# EAGLE design PGTN021_octasource_mkiii_controls (EAGLE 9.6.0)
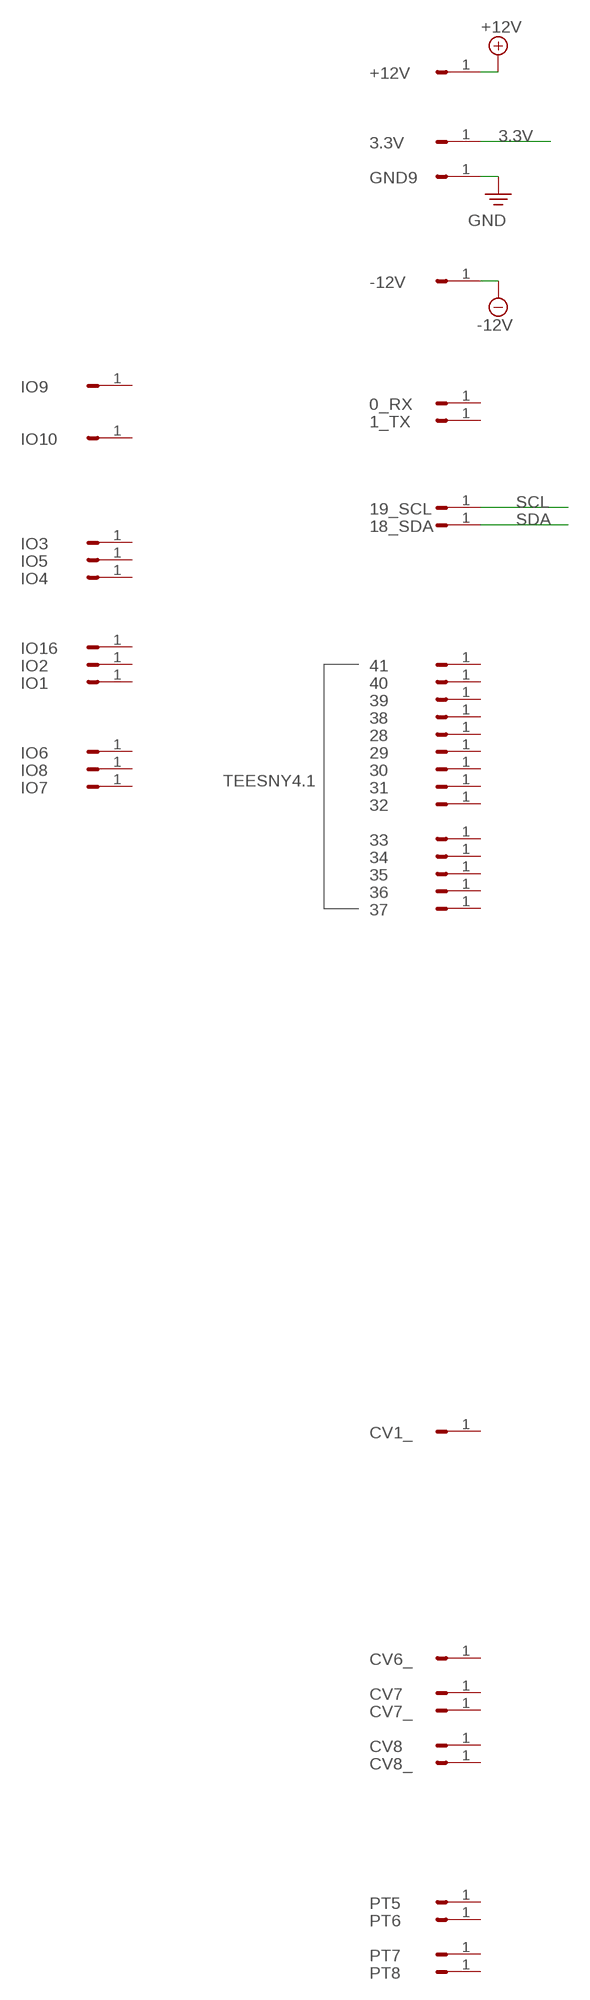
[diagram p0: schematic, sheet 1, part 1 of 2]
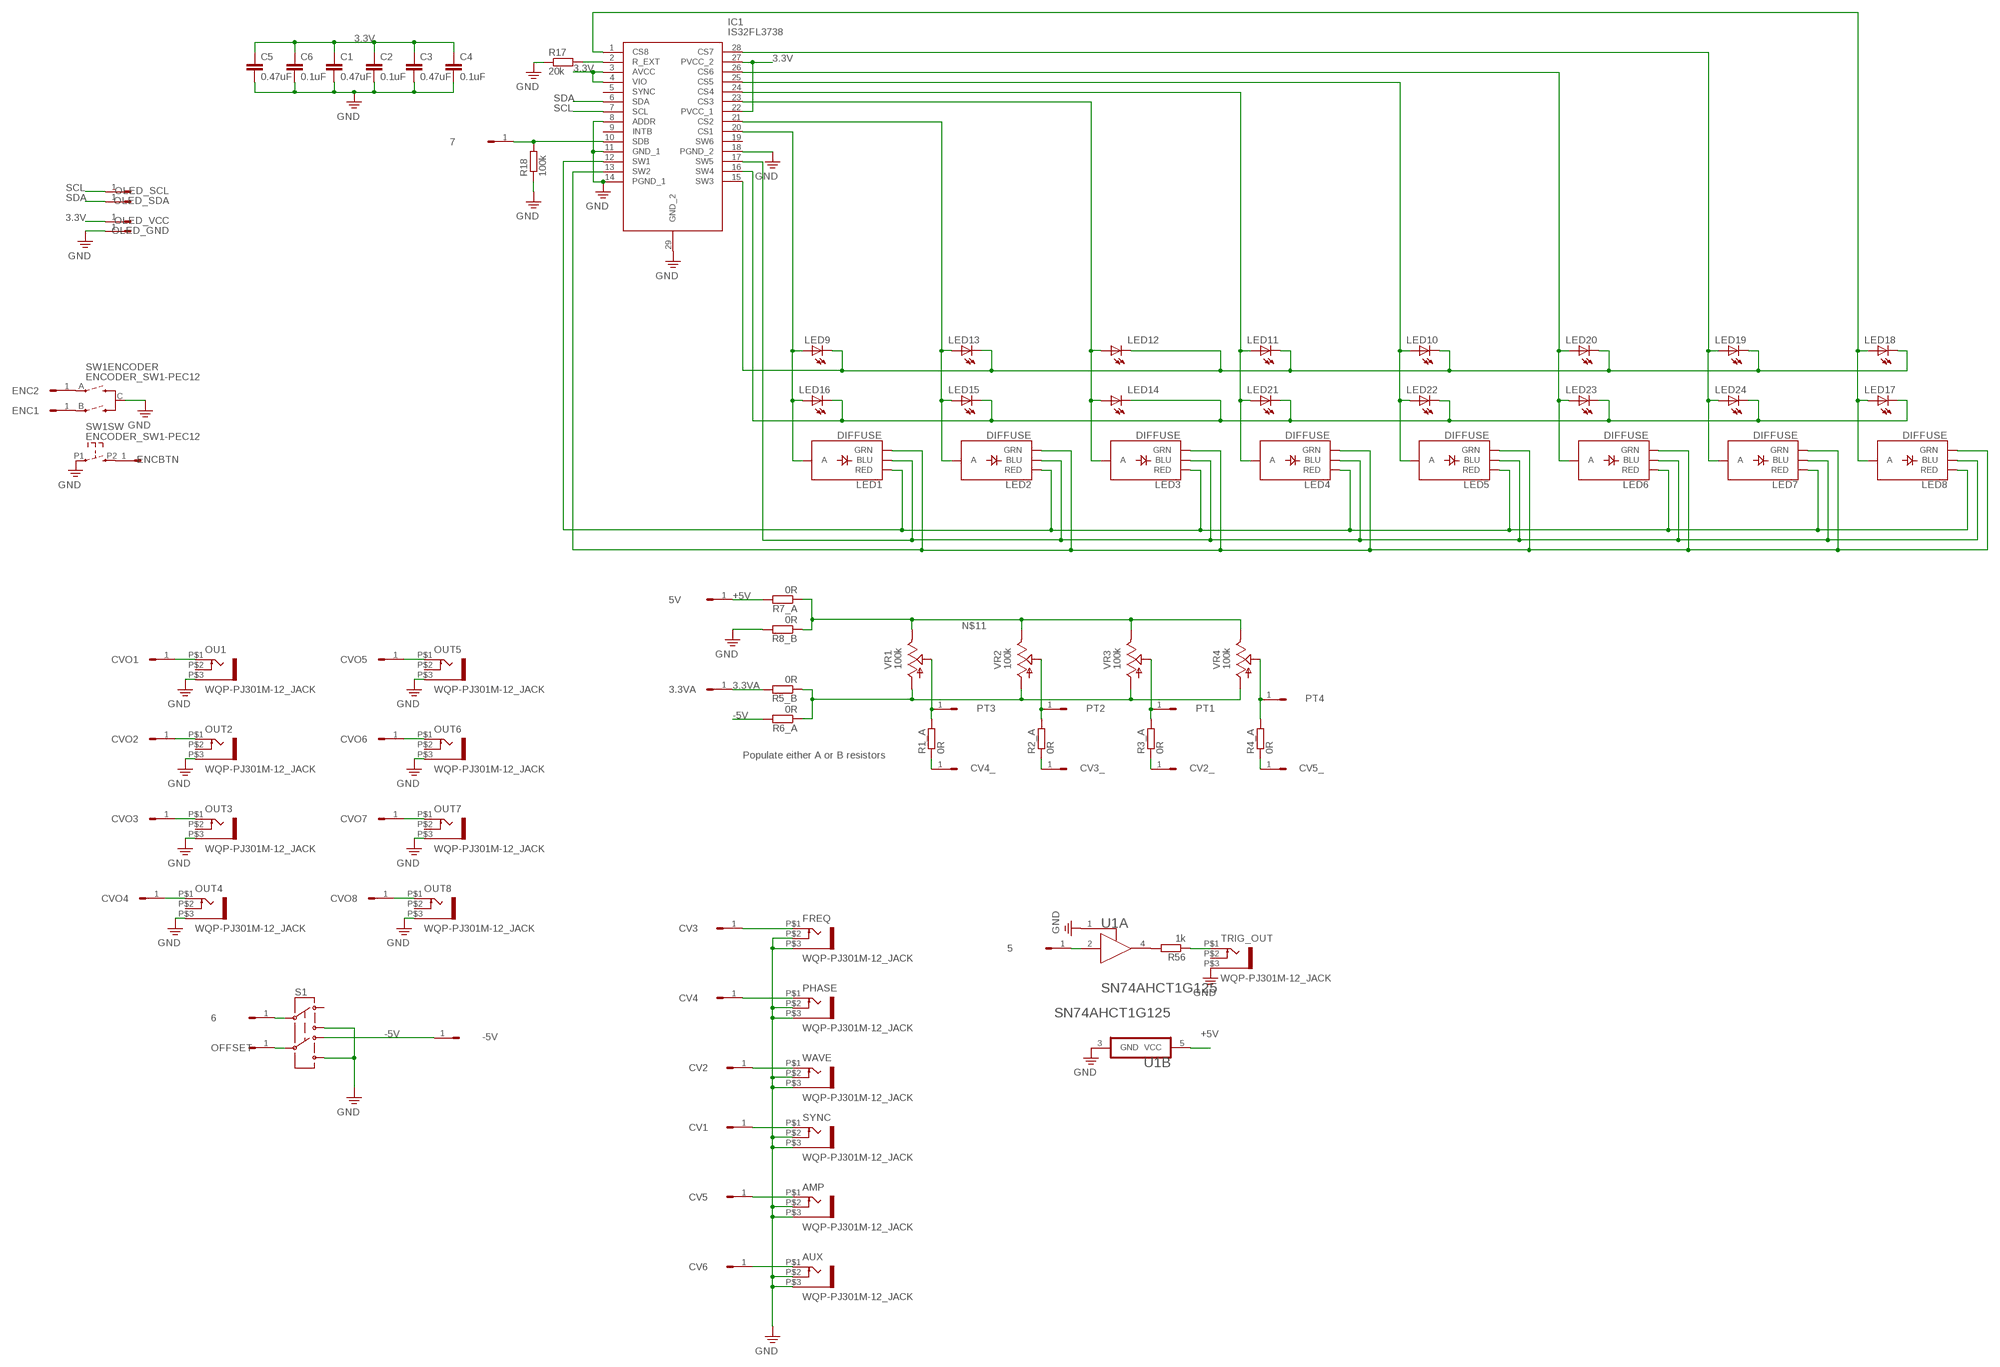
[diagram p1: schematic, sheet 1, part 2 of 2]

## Parts
0_RX  HEADER/MALE/01  [HEADER/MALE/01]
1_TX  HEADER/MALE/01  [HEADER/MALE/01]
3.3V  HEADER/MALE/01  [HEADER/MALE/01]
3.3VA  HEADER/MALE/01  [HEADER/MALE/01]
5  HEADER/MALE/01  [HEADER/MALE/01]
5V  HEADER/MALE/01  [HEADER/MALE/01]
6  HEADER/MALE/01  [HEADER/MALE/01]
7  HEADER/MALE/01  [HEADER/MALE/01]
18_SDA  HEADER/MALE/01  [HEADER/MALE/01]
19_SCL  HEADER/MALE/01  [HEADER/MALE/01]
28  HEADER/MALE/01  [HEADER/MALE/01]
29  HEADER/MALE/01  [HEADER/MALE/01]
30  HEADER/MALE/01  [HEADER/MALE/01]
31  HEADER/MALE/01  [HEADER/MALE/01]
32  HEADER/MALE/01  [HEADER/MALE/01]
33  HEADER/MALE/01  [HEADER/MALE/01]
34  HEADER/MALE/01  [HEADER/MALE/01]
35  HEADER/MALE/01  [HEADER/MALE/01]
36  HEADER/MALE/01  [HEADER/MALE/01]
37  HEADER/MALE/01  [HEADER/MALE/01]
38  HEADER/MALE/01  [HEADER/MALE/01]
39  HEADER/MALE/01  [HEADER/MALE/01]
40  HEADER/MALE/01  [HEADER/MALE/01]
41  HEADER/MALE/01  [HEADER/MALE/01]
+12V  HEADER/MALE/01  [HEADER/MALE/01]
-5V  HEADER/MALE/01  [HEADER/MALE/01]
-12V  HEADER/MALE/01  [HEADER/MALE/01]
AMP  WQP-PJ301M-12_JACK  [WQP-PJ301M-12_JACK]
AUX  WQP-PJ301M-12_JACK  [WQP-PJ301M-12_JACK]
C1  0.47uF  CAPACITORC0603  [C0603]
C2  0.1uF  CAPACITORC0603  [C0603]
C3  0.47uF  CAPACITORC0603  [C0603]
C4  0.1uF  CAPACITORC0603  [C0603]
C5  0.47uF  CAPACITORC0603  [C0603]
C6  0.1uF  CAPACITORC0603  [C0603]
CV1  HEADER/MALE/01  [HEADER/MALE/01]
CV1_  HEADER/MALE/01  [HEADER/MALE/01]
CV2  HEADER/MALE/01  [HEADER/MALE/01]
CV2_  HEADER/MALE/01  [HEADER/MALE/01]
CV3  HEADER/MALE/01  [HEADER/MALE/01]
CV3_  HEADER/MALE/01  [HEADER/MALE/01]
CV4  HEADER/MALE/01  [HEADER/MALE/01]
CV4_  HEADER/MALE/01  [HEADER/MALE/01]
CV5  HEADER/MALE/01  [HEADER/MALE/01]
CV5_  HEADER/MALE/01  [HEADER/MALE/01]
CV6  HEADER/MALE/01  [HEADER/MALE/01]
CV6_  HEADER/MALE/01  [HEADER/MALE/01]
CV7  HEADER/MALE/01  [HEADER/MALE/01]
CV7_  HEADER/MALE/01  [HEADER/MALE/01]
CV8  HEADER/MALE/01  [HEADER/MALE/01]
CV8_  HEADER/MALE/01  [HEADER/MALE/01]
CVO1  HEADER/MALE/01  [HEADER/MALE/01]
CVO2  HEADER/MALE/01  [HEADER/MALE/01]
CVO3  HEADER/MALE/01  [HEADER/MALE/01]
CVO4  HEADER/MALE/01  [HEADER/MALE/01]
CVO5  HEADER/MALE/01  [HEADER/MALE/01]
CVO6  HEADER/MALE/01  [HEADER/MALE/01]
CVO7  HEADER/MALE/01  [HEADER/MALE/01]
CVO8  HEADER/MALE/01  [HEADER/MALE/01]
ENC1  HEADER/MALE/01  [HEADER/MALE/01]
ENC2  HEADER/MALE/01  [HEADER/MALE/01]
ENCBTN  HEADER/MALE/01  [HEADER/MALE/01]
FREQ  WQP-PJ301M-12_JACK  [WQP-PJ301M-12_JACK]
GND9  HEADER/MALE/01  [HEADER/MALE/01]
IC1  IS32FL3738  [TSSOP29]
IO1  HEADER/MALE/01  [HEADER/MALE/01]
IO2  HEADER/MALE/01  [HEADER/MALE/01]
IO3  HEADER/MALE/01  [HEADER/MALE/01]
IO4  HEADER/MALE/01  [HEADER/MALE/01]
IO5  HEADER/MALE/01  [HEADER/MALE/01]
IO6  HEADER/MALE/01  [HEADER/MALE/01]
IO7  HEADER/MALE/01  [HEADER/MALE/01]
IO8  HEADER/MALE/01  [HEADER/MALE/01]
IO9  HEADER/MALE/01  [HEADER/MALE/01]
IO10  HEADER/MALE/01  [HEADER/MALE/01]
IO16  HEADER/MALE/01  [HEADER/MALE/01]
LED1  DIFFUSE  LED-RGB-CADIFFUSE  [LED-RGB-THRU]
LED2  DIFFUSE  LED-RGB-CADIFFUSE  [LED-RGB-THRU]
LED3  DIFFUSE  LED-RGB-CADIFFUSE  [LED-RGB-THRU]
LED4  DIFFUSE  LED-RGB-CADIFFUSE  [LED-RGB-THRU]
LED5  DIFFUSE  LED-RGB-CADIFFUSE  [LED-RGB-THRU]
LED6  DIFFUSE  LED-RGB-CADIFFUSE  [LED-RGB-THRU]
LED7  DIFFUSE  LED-RGB-CADIFFUSE  [LED-RGB-THRU]
LED8  DIFFUSE  LED-RGB-CADIFFUSE  [LED-RGB-THRU]
LED9  LEDCHIPLED_0805  [CHIPLED_0805]
LED10  LEDCHIPLED_0805  [CHIPLED_0805]
LED11  LEDCHIPLED_0805  [CHIPLED_0805]
LED12  LEDCHIPLED_0805  [CHIPLED_0805]
LED13  LEDCHIPLED_0805  [CHIPLED_0805]
LED14  LEDCHIPLED_0805  [CHIPLED_0805]
LED15  LEDCHIPLED_0805  [CHIPLED_0805]
LED16  LEDCHIPLED_0805  [CHIPLED_0805]
LED17  LEDCHIPLED_0805  [CHIPLED_0805]
LED18  LEDCHIPLED_0805  [CHIPLED_0805]
LED19  LEDCHIPLED_0805  [CHIPLED_0805]
LED20  LEDCHIPLED_0805  [CHIPLED_0805]
LED21  LEDCHIPLED_0805  [CHIPLED_0805]
LED22  LEDCHIPLED_0805  [CHIPLED_0805]
LED23  LEDCHIPLED_0805  [CHIPLED_0805]
LED24  LEDCHIPLED_0805  [CHIPLED_0805]
OFFSET  HEADER/MALE/01  [HEADER/MALE/01]
OLED_GND  HEADER/MALE/01  [HEADER/MALE/01]
OLED_SCL  HEADER/MALE/01  [HEADER/MALE/01]
OLED_SDA  HEADER/MALE/01  [HEADER/MALE/01]
OLED_VCC  HEADER/MALE/01  [HEADER/MALE/01]
OU1  WQP-PJ301M-12_JACK  [WQP-PJ301M-12_JACK]
OUT2  WQP-PJ301M-12_JACK  [WQP-PJ301M-12_JACK]
OUT3  WQP-PJ301M-12_JACK  [WQP-PJ301M-12_JACK]
OUT4  WQP-PJ301M-12_JACK  [WQP-PJ301M-12_JACK]
OUT5  WQP-PJ301M-12_JACK  [WQP-PJ301M-12_JACK]
OUT6  WQP-PJ301M-12_JACK  [WQP-PJ301M-12_JACK]
OUT7  WQP-PJ301M-12_JACK  [WQP-PJ301M-12_JACK]
OUT8  WQP-PJ301M-12_JACK  [WQP-PJ301M-12_JACK]
PHASE  WQP-PJ301M-12_JACK  [WQP-PJ301M-12_JACK]
PT1  HEADER/MALE/01  [HEADER/MALE/01]
PT2  HEADER/MALE/01  [HEADER/MALE/01]
PT3  HEADER/MALE/01  [HEADER/MALE/01]
PT4  HEADER/MALE/01  [HEADER/MALE/01]
PT5  HEADER/MALE/01  [HEADER/MALE/01]
PT6  HEADER/MALE/01  [HEADER/MALE/01]
PT7  HEADER/MALE/01  [HEADER/MALE/01]
PT8  HEADER/MALE/01  [HEADER/MALE/01]
R1_A  0R  RESISTOR  [R0603]
R2_A  0R  RESISTOR  [R0603]
R3_A  0R  RESISTOR  [R0603]
R4_A  0R  RESISTOR  [R0603]
R5_B  0R  RESISTOR  [R0603]
R6_A  0R  RESISTOR  [R0603]
R7_A  0R  RESISTOR  [R0603]
R8_B  0R  RESISTOR  [R0603]
R17  20k  RESISTOR  [R0603]
R18  100k  RESISTOR  [R0603]
R56  1k  RESISTOR  [R0603]
S1  SWITCH-DPDTPTH2  [SWITCH-DPDT_SUB_ROUND]
SW1  ENCODER_SW1-PEC12  [PEC12_INCREMENTAL_ENCODER]
SYNC  WQP-PJ301M-12_JACK  [WQP-PJ301M-12_JACK]
TRIG_OUT  WQP-PJ301M-12_JACK  [WQP-PJ301M-12_JACK]
U1  74AHCT1G125  74AHCT1G125"  [74AHCT1G125]
VR1  100k  9MM_SNAP-IN_POT_  [9MM_SNAP-IN_POT]
VR2  100k  9MM_SNAP-IN_POT_  [9MM_SNAP-IN_POT]
VR3  100k  9MM_SNAP-IN_POT_  [9MM_SNAP-IN_POT]
VR4  100k  9MM_SNAP-IN_POT_  [9MM_SNAP-IN_POT]
WAVE  WQP-PJ301M-12_JACK  [WQP-PJ301M-12_JACK]

## Nets
3.3V: 3.3V.1 C1.1 C2.1 C3.1 C4.1 C5.1 C6.1 IC1.3(AVCC) IC1.4(VIO) IC1.22(PVCC_1) IC1.27(PVCC_2) OLED_VCC.1
3.3VA: 3.3VA.1 R5_B.2
+5V: 5V.1 R7_A.2 U1.5(B:VCC)
+12V: +12V.1
-5V: -5V.1 R6_A.2 S1.4
-12V: -12V.1
N$1: IC1.12(SW1) LED1.1(RED) LED2.1(RED) LED3.1(RED) LED4.1(RED) LED5.1(RED) LED6.1(RED) LED7.1(RED) LED8.1(RED)
N$2: PT3.1 R1_A.2 VR1.2(S)
N$3: IC1.17(SW5) LED1.4(BLU) LED2.4(BLU) LED3.4(BLU) LED4.4(BLU) LED5.4(BLU) LED6.4(BLU) LED7.4(BLU) LED8.4(BLU)
N$4: CVO1.1 OU1.P$1
N$5: 6.1 S1.2
N$6: IC1.13(SW2) LED1.3(GRN) LED2.3(GRN) LED3.3(GRN) LED4.3(GRN) LED5.3(GRN) LED6.3(GRN) LED7.3(GRN) LED8.3(GRN)
N$7: PT2.1 R2_A.2 VR2.2(S)
N$8: CVO2.1 OUT2.P$1
N$9: PT1.1 R3_A.2 VR3.2(S)
N$10: PT4.1 R4_A.2 VR4.2(S)
N$11: R7_A.1 R8_B.1 VR1.3(E) VR2.3(E) VR3.3(E) VR4.3(E)
N$12: CVO3.1 OUT3.P$1
N$13: OFFSET.1 S1.5
N$14: AUX.P$1 CV6.1
N$15: CV4_.1 R1_A.1
N$16: CVO4.1 OUT4.P$1
N$17: CV3_.1 R2_A.1
N$18: CV2_.1 R3_A.1
N$19: CV5_.1 R4_A.1
N$20: CVO5.1 OUT5.P$1
N$21: R5_B.1 R6_A.1 VR1.1(A) VR2.1(A) VR3.1(A) VR4.1(A)
N$24: CVO6.1 OUT6.P$1
N$28: CVO7.1 OUT7.P$1
N$32: CVO8.1 OUT8.P$1
N$33: 7.1 IC1.10(SDB) R18.2
N$34: R56.2 U1.4(A:Y)
N$35: 5.1 U1.2(A:A)
N$36: ENCBTN.1 SW1.P2
N$37: ENC2.1 SW1.A(ENCODER:A)
N$38: ENC1.1 SW1.B(ENCODER:B)
N$39: CV1.1 SYNC.P$1
N$41: CV2.1 WAVE.P$1
N$42: CV3.1 FREQ.P$1
N$43: CV4.1 PHASE.P$1
N$44: AMP.P$1 CV5.1
N$49: R56.1 TRIG_OUT.P$1
N$50: IC1.20(CS1) LED1.2(A) LED9.A LED16.A
N$51: IC1.21(CS2) LED2.2(A) LED13.A LED15.A
N$52: IC1.23(CS3) LED3.2(A) LED12.A LED14.A
N$62: IC1.16(SW4) LED14.C LED15.C LED16.C LED17.C LED21.C LED22.C LED23.C LED24.C
N$63: IC1.15(SW3) LED9.C LED10.C LED11.C LED12.C LED13.C LED18.C LED19.C LED20.C
N$65: IC1.24(CS4) LED4.2(A) LED11.A LED21.A
N$66: IC1.25(CS5) LED5.2(A) LED10.A LED22.A
N$67: IC1.26(CS6) LED6.2(A) LED20.A LED23.A
N$68: IC1.28(CS7) LED7.2(A) LED19.A LED24.A
N$69: IC1.1(CS8) LED8.2(A) LED17.A LED18.A
N$70: IC1.2(R_EXT) R17.2
PE: AMP.P$2 AMP.P$3 AUX.P$2 AUX.P$3 C1.2 C2.2 C3.2 C4.2 C5.2 C6.2 FREQ.P$2 FREQ.P$3 GND9.1 IC1.8(ADDR) IC1.11(GND_1) IC1.14(PGND_1) IC1.18(PGND_2) IC1.29(GND_2) OLED_GND.1 OU1.P$3 OUT2.P$3 OUT3.P$3 OUT4.P$3 OUT5.P$3 OUT6.P$3 OUT7.P$3 OUT8.P$3 PHASE.P$2 PHASE.P$3 R8_B.2 R17.1 R18.1 S1.3 S1.6 SW1.C(ENCODER:C) SW1.P1 SYNC.P$2 SYNC.P$3 TRIG_OUT.P$3 U1.1(A:!OE!) U1.3(B:GND) WAVE.P$2 WAVE.P$3 ; supply symbol labelled GND
SCL: 19_SCL.1 IC1.7(SCL) OLED_SCL.1
SDA: 18_SDA.1 IC1.6(SDA) OLED_SDA.1
Unconnected: 0_RX.1 1_TX.1 28.1 29.1 30.1 31.1 32.1 33.1 34.1 35.1 36.1 37.1 38.1 39.1 40.1 41.1 CV1_.1 CV6_.1 CV7.1 CV7_.1 CV8.1 CV8_.1 IC1.5(SYNC) IC1.9(INTB) IC1.19(SW6) IO1.1 IO2.1 IO3.1 IO4.1 IO5.1 IO6.1 IO7.1 IO8.1 IO9.1 IO10.1 IO16.1 OU1.P$2 OUT2.P$2 OUT3.P$2 OUT4.P$2 OUT5.P$2 OUT6.P$2 OUT7.P$2 OUT8.P$2 PT5.1 PT6.1 PT7.1 PT8.1 S1.1 TRIG_OUT.P$2

## Notes on the sheet
- TEESNY4.1
- Populate either A or B resistors

## Library data of the parts
0_RX 1_TX 3.3V 3.3VA 5 5V 6 7 18_SDA 19_SCL 28-41 +12V -5V -12V CV1 CV1_ CV2 CV2_ CV3 CV3_ CV4 CV4_ CV5 CV5_ CV6 CV6_ CV7 CV7_ CV8 CV8_ CVO1-CVO8 ENC1 ENC2 ENCBTN GND9 IO1-IO10 IO16 OFFSET OLED_GND OLED_SCL OLED_SDA OLED_VCC PT1-PT8 = connectors:HEADER/MALE/01; SPICEPREFIX: X
AMP AUX FREQ OU1 OUT2-OUT8 PHASE SYNC TRIG_OUT WAVE = controls:WQP-PJ301M-12_JACK
C1-C6 = capacitors:CAPACITOR: CAPACITOR, European symbol
IC1 = ic_digital:IS32FL3738: IC LED DRIVER 6X8 28TSSOP Source: Datasheet <http://www.issi.com/WW/pdf/IS32FL3738.pdf>; DESCRIPTION: IC LED DRIVER 6X8 28TSSOP; HEIGHT: 1.2mm; MANUFACTURER_NAME: ISSI, Integrated Silicon Solution Inc; MANUFACTURER_PART_NUMBER: IS32FL3738-ZLA3-TR
LED1-LED8 = display_led:LED-RGB-CA: LED-RGB Diffused Common Anode Packages: LED RGB-THRU P-LCC-4-3 LED-TRICOLOR-SMD SparkFun Products: RGB Diffused Common Anode- Diffuse <[https://www.sparkfun.com/products/10821]> RGB Diffused Common Anode - Clear <[https://www.sparkfun.com/products/10820]> Qduino Mini <[https://www.sparkfun.com/products/13614]> Triple Output LED RGB - SMD <https://www.sparkfun.com/products/7844>; PROD_ID: DIO-10632
LED9-LED24 = display_led:LED: LED OSRAM: - CHIPLED LG R971, LG N971, LY N971, LG Q971, LY Q971, LO R971, LY R971 LH N974, LH R974 LS Q976, LO Q976, LY Q976 LO Q996 - Hyper CHIPLED LW Q18S LB Q993, LB Q99A, LB R99A - SideLED LS A670, LO A670, LY A670, LG A670, LP A670 LB A673, LV A673, LT A673, LW A673 LH A674 LY A675 LS A676, LA A676, LO A676, LY A676, LW A676 LS A679, LY A679, LG A679 - Hyper Micro SIDELED® LS Y876, LA Y876, LO Y876, LY Y876 LT Y87S - SmartLED LW L88C, LW L88S LB L89C, LB L89S, LG L890 LS L89K, LO L89K, LY L89K LS L896, LA L896, LO L896, LY L896 - TOPLED LS T670, LO T670, LY T670, LG T670, LP T670 LSG T670, LSP T670, LSY T670, LOP T670, LYG T670 LG T671, LOG T671, LSG T671 LB T673, LV T673, LT T673, LW T673 LH T674 LS T676, LA T676, LO T676, LY T676, LB T676, LH T676, LSB T676, LW T676 LB T67C, LV T67C, LT T67C, LS T67K, LO T67K, LY T67K, LW E67C LS E67B, LA E67B, LO E67B, LY E67B, LB E67C, LV E67C, LT E67C LW T67C LS T679, LY T679, LG T679 LS T770, LO T770, LY T770, LG T770, LP T770 LB T773, LV T773, LT T773, LW T773 LH T774 LS E675, LA E675, LY E675, LS T675 LS T776, LA T776, LO T776, LY T776, LB T776 LHGB T686 LT T68C, LB T68C - Hyper Mini TOPLED® LB M676 - Mini TOPLED Santana® LG M470 LS M47K, LO M47K, LY M47K Source: http://www.osram.convergy.de LUXEON: - LUMILED® LXK2-PW12-R00, LXK2-PW12-S00, LXK2-PW14-U00, LXK2-PW14-V00 LXK2-PM12-R00, LXK2-PM12-S00, LXK2-PM14-U00 LXK2-PE12-Q00, LXK2-PE12-R00, LXK2-PE12-S00, LXK2-PE14-T00, LXK2-PE14-U00 LXK2-PB12-K00, LXK2-PB12-L00, LXK2-PB12-M00, LXK2-PB14-N00, LXK2-PB14-P00, LXK2-PB14-Q00 LXK2-PR12-L00, LXK2-PR12-M00, LXK2-PR14-Q00, LXK2-PR14-R00 LXK2-PD12-Q00, LXK2-PD12-R00, LXK2-PD12-S00 LXK2-PH12-R00, LXK2-PH12-S00 LXK2-PL12-P00, LXK2-PL12-Q00, LXK2-PL12-R00 Source: www.luxeon.com KINGBRIGHT: KA-3528ASYC Source: www.kingbright.com
R1_A R2_A R3_A R4_A R5_B R6_A R7_A R8_B R17 R18 R56 = resistors:RESISTOR: RESISTOR, European symbol
S1 = electromechanical:SWITCH-DPDT: DPDT Version of the COM-00597
SW1 = controls:ENCODER_SW1: Incremental Encoder with push switch
U1 = ic_digital:74AHCT1G125: TI-SN74AXXXX1X125-5; 3_STATE_OUTPUT: Yes; BITS: 1; CIIVA_IDS: 19361320; DATASHEET_VERSION: SCLS378M; FOOTPRINT_VARIANT_NAME_0: Level C; FOOTPRINT_VARIANT_NAME_1: Level B; FOOTPRINT_VARIANT_NAME_2: Level A; F__NOM_VOLTAGEMAXMHZ: 75; ICC__NOM_VOLTAGEMAXMA: 0.01; IMPORTED: yes; IMPORTED_FROM: vault; IMPORT_TS: 1521860152; INPUT_TYPE: CMOS; LOGIC: true; MF: Texas Instruments; MPN: SN74AHCT1G125; OPERATING_TEMPERATURE_RANGEC: -40 to 125; OUTPUT_DRIVE_IOLIOHMAXMA: 8/-8; OUTPUT_TYPE: CMOS; PACKAGE: DBV0005A; PIN_0_0_1_OUTSIDE_EDGE: dot; PREFIX: U; RATING: Catalog; RELEASE_DATE: 1459324136; SCHMITT_TRIGGER: No; SUB__FAMILY: Non-Inverting Buffer/Driver; TECHNOLOGY_FAMILY: AHCT; TPD__NOM_VOLTAGEMAXNS: 6; VAULT_GUID: D4F6E077-2F5C-4B23-8C12-AA7674079390; VAULT_REVISION: 30C08C77-DC7B-43EA-A3AC-F2B0253DD8E6; VCC_MAX_V: 5.5; VCC_MIN_V: 2; VOLTAGE_NOM_V: 5
VR1-VR4 = controls:9MM_SNAP-IN_POT: 9mm vertical snap-in pot, Alpha / Panasonic style

## Board
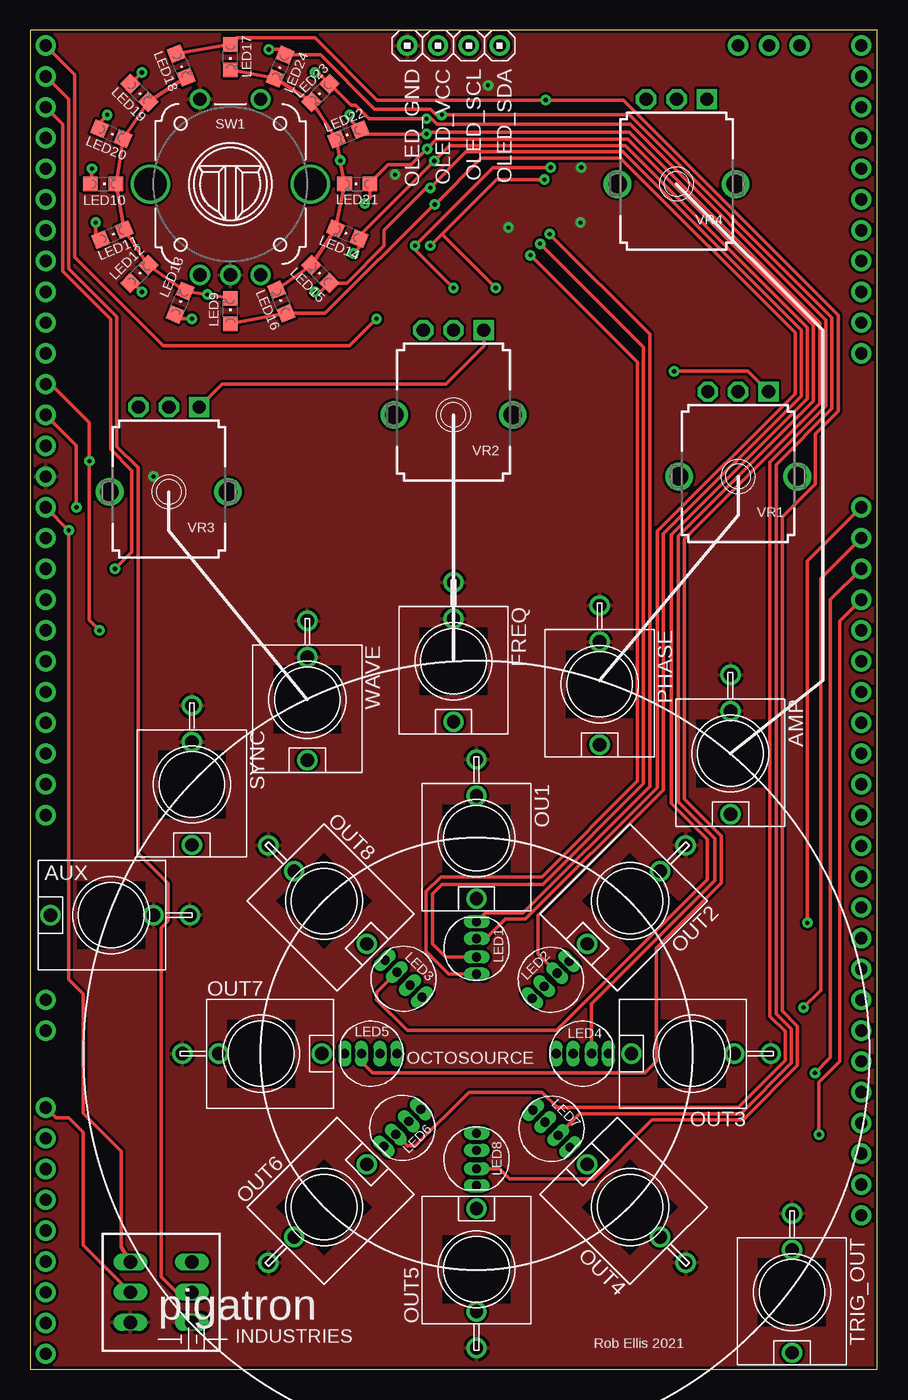
[diagram p2: board, top side]
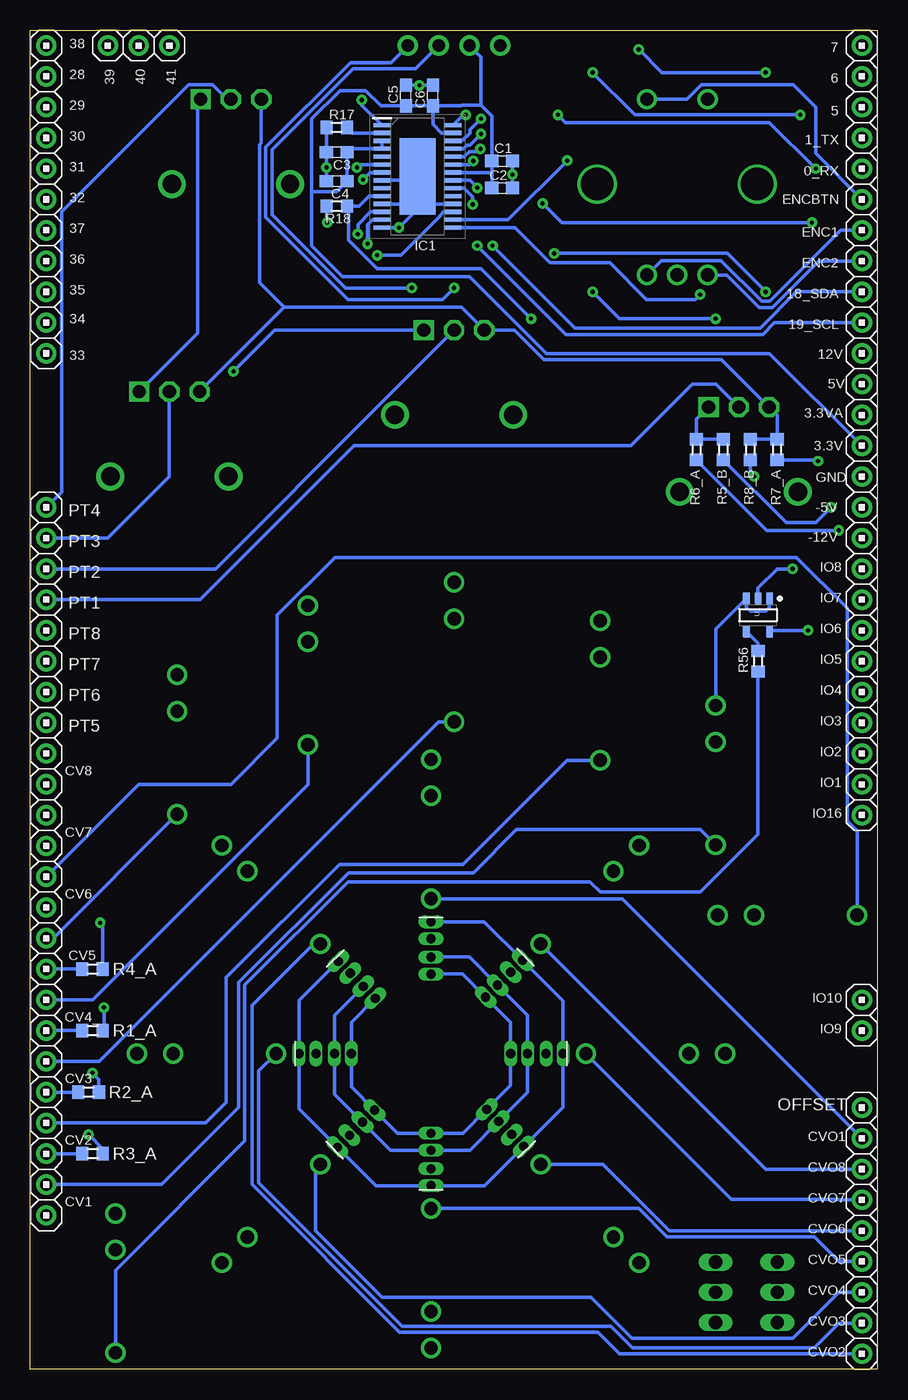
[diagram p3: board, bottom side, seen from below]

Size 69.9 x 110.48 mm. Coordinates in mm from the lower left corner, seen from the top.
Outline: 0,0 69.9,0 69.9,110.48 0,110.48 0,0
Copper layers (1*16): Top 0.0356mm / dielectric 1.5011mm / Bottom 0.0356mm
Design rules "pigatron *": minimum track width 8mil, minimum drill 13mil, track to track 8mil, track to pad 8mil, pad to pad 8mil, via to via 8mil, smd to smd 6mil, copper to edge 10mil, drill to drill 10mil, minimum pad ring 6mil, minimum via ring 10mil, stop-mask expansion 4mil, vias tented up to drill 15mil, thermal gap 10mil

### Footprints (pad centres in the part's own frame; a part is rotated, then mirrored left to right if it is on the bottom)
HEADER/MALE/01 = drill 1.016 pad 1.676: 1 0,0
WQP-PJ301M-12_JACK = drill 1.1 pad 1.676: P$1 0,5; P$2 0,-3.5; P$3 0,-6.5
C0603 = smd 1.1 x 1: 1 -0.85,0; 2 0.85,0
TSSOP29 = smd 1.4 x 0.35: 1 -2.938,4.225; 2 -2.938,3.575; 3 -2.938,2.925; 4 -2.938,2.275; 5 -2.938,1.625; 6 -2.938,0.975; 7 -2.938,0.325; 8 -2.938,-0.325; 9 -2.938,-0.975; 10 -2.938,-1.625; 11 -2.938,-2.275; 12 -2.938,-2.925; 13 -2.938,-3.575; 14 -2.938,-4.225; 15 2.938,-4.225; 16 2.938,-3.575; 17 2.938,-2.925; 18 2.938,-2.275; 19 2.938,-1.625; 20 2.938,-0.975; 21 2.938,-0.325; 22 2.938,0.325; 23 2.938,0.975; 24 2.938,1.625; 25 2.938,2.275; 26 2.938,2.925; 27 2.938,3.575; 28 2.938,4.225 | smd 3 x 6.3: 29 0,0
LED-RGB-THRU = drill 0.762 pad 0.889 long: 1 2.159,0; 2 0.762,0; 3 -0.762,0; 4 -2.159,0
CHIPLED_0805 = smd 1.2 x 1.2: A 0,-1.05; C 0,1.05
R0603 = smd 1 x 1.1: 1 -0.85,0; 2 0.85,0
SWITCH-DPDT_SUB_ROUND = drill 1.092 pad 1.422 long: 1 -2.54,-2.489; 2 -2.54,0; 3 -2.54,2.489; 4 2.54,-2.489; 5 2.54,0; 6 2.54,2.489
PEC12_INCREMENTAL_ENCODER = drill 1.1 pad 1.676: A -2.5,-7.5; B 2.5,-7.5; C 0,-7.5; P1 -2.5,7; P2 2.5,7 | drill 2.692: GND@1 -6.6,0; GND@2 6.6,0
74AHCT1G125 = smd 1 x 0.6: 1 -1.375,0.95; 2 -1.375,0; 3 -1.375,-0.95; 4 1.375,-0.95; 5 1.375,0.95
9MM_SNAP-IN_POT = drill 1.1 pad 1.676 square: 1 -2.5,-7 | drill 1.1 pad 1.676 octagon: 2 0,-7; 3 2.5,-7 | drill 1.524 pad 2.286: CHASSIS1 -4.881,0; CHASSIS2 4.881,0

### Placement (x,y rotation side)
0_RX  1.27,99.06 180 bottom
1_TX  1.27,101.6 180 bottom
3.3V  1.27,76.2 90 bottom
3.3VA  1.27,78.74 0 bottom
5  1.27,104.14 180 bottom
5V  1.27,81.28 180 bottom
6  1.27,106.68 180 bottom
7  1.27,109.22 180 bottom
18_SDA  1.27,88.9 180 bottom
19_SCL  1.27,86.36 180 bottom
28  68.58,106.68 0 bottom
29  68.58,104.14 0 bottom
30  68.58,101.6 0 bottom
31  68.58,99.06 0 bottom
32  68.58,96.52 0 bottom
33  68.58,83.82 0 bottom
34  68.58,86.36 0 bottom
35  68.58,88.9 0 bottom
36  68.58,91.44 0 bottom
37  68.58,93.98 0 bottom
38  68.58,109.22 0 bottom
39  63.5,109.22 270 bottom
40  60.96,109.22 270 bottom
41  58.42,109.22 270 bottom
+12V  1.27,83.82 0 bottom
-5V  1.27,71.12 0 bottom
-12V  1.27,68.58 0 bottom
AMP  57.78,50.8 180 top
AUX  6.67,37.47 90 top
C1  30.96,99.69 0 bottom
C2  30.96,97.47 0 bottom
C3  44.61,100.41 180 bottom
C4  44.61,98.03 180 bottom
C5  38.89,105.09 90 bottom
C6  36.67,105.09 90 bottom
CV1  68.58,15.24 0 bottom
CV1_  68.58,12.7 0 bottom
CV2  68.58,20.32 0 bottom
CV2_  68.58,17.78 0 bottom
CV3  68.58,25.4 0 bottom
CV3_  68.58,22.86 0 bottom
CV4  68.58,30.48 0 bottom
CV4_  68.58,27.94 0 bottom
CV5  68.58,35.56 180 bottom
CV5_  68.58,33.02 180 bottom
CV6  68.58,40.64 180 bottom
CV6_  68.58,38.1 180 bottom
CV7  68.58,43.18 180 bottom
CV7_  68.58,45.72 180 bottom
CV8  68.58,50.8 180 bottom
CV8_  68.58,48.26 180 bottom
CVO1  1.27,19.05 0 bottom
CVO2  1.27,1.27 0 bottom
CVO3  1.27,3.81 0 bottom
CVO4  1.27,6.35 0 bottom
CVO5  1.27,8.89 0 bottom
CVO6  1.27,11.43 0 bottom
CVO7  1.27,13.97 0 bottom
CVO8  1.27,16.51 0 bottom
ENC1  1.27,93.98 180 bottom
ENC2  1.27,91.44 180 bottom
ENCBTN  1.27,96.52 180 bottom
FREQ  34.92,58.42 180 top
GND9  1.27,73.66 0 bottom
IC1  37.94,98.42 0 bottom
IO1  1.27,48.26 180 bottom
IO2  1.27,50.8 180 bottom
IO3  1.27,53.34 180 bottom
IO4  1.27,55.88 180 bottom
IO5  1.27,58.42 180 bottom
IO6  1.27,60.96 180 bottom
IO7  1.27,63.5 180 bottom
IO8  1.27,66.04 180 bottom
IO9  1.27,27.94 180 bottom
IO10  1.27,30.48 180 bottom
IO16  1.27,45.72 180 bottom
LED1  36.83,34.77 90 top
LED2  42.96,32.13 45 top
LED3  30.8,32.23 135 top
LED4  45.56,26.04 0 top
LED5  28.1,26.04 180 top
LED6  30.7,19.91 225 top
LED7  43.02,19.84 315 top
LED8  36.83,17.3 270 top
LED9  16.51,87.31 0 top
LED10  6.03,97.79 270 top
LED11  6.77,93.62 292.5 top
LED12  8.99,90.37 315 top
LED13  12.36,88.01 337.5 top
LED14  26.15,93.69 67.5 top
LED15  23.94,90.37 45 top
LED16  20.71,88.09 22.5 top
LED17  16.51,108.27 180 top
LED18  12.45,107.56 202.5 top
LED19  8.99,105.32 225 top
LED20  6.68,101.95 247.5 top
LED21  26.99,97.79 90 top
LED22  26.24,101.88 112.5 top
LED23  23.94,105.32 135 top
LED24  20.62,107.48 157.5 top
OFFSET  1.27,21.59 0 bottom
OLED_GND  31.11,109.22 270 top
OLED_SCL  36.2,109.22 270 top
OLED_SDA  38.73,109.22 270 top
OLED_VCC  33.66,109.22 270 top
OU1  36.83,43.81 180 top
OUT2  49.5,38.63 135 top
OUT3  54.61,26.04 90 top
OUT4  49.5,13.37 45 top
OUT5  36.83,8.26 0 top
OUT6  24.25,13.37 315 top
OUT7  19.05,26.04 270 top
OUT8  24.25,38.63 225 top
PHASE  46.99,56.52 180 top
PT1  68.58,63.5 180 bottom
PT2  68.58,66.04 180 bottom
PT3  68.58,68.58 180 bottom
PT4  68.58,71.12 180 bottom
PT5  68.58,53.34 180 bottom
PT6  68.58,55.88 180 bottom
PT7  68.58,58.42 180 bottom
PT8  68.58,60.96 180 bottom
R1_A  64.77,27.94 0 bottom
R2_A  65.09,22.86 0 bottom
R3_A  64.77,17.78 0 bottom
R4_A  64.77,33.02 0 bottom
R5_B  12.7,75.88 270 bottom
R6_A  14.92,75.88 270 bottom
R7_A  8.26,75.88 270 bottom
R8_B  10.48,75.88 270 bottom
R17  44.61,102.47 0 bottom
R18  44.61,95.96 0 bottom
R56  9.84,58.42 90 bottom
S1  10.79,6.35 180 top
SW1  16.51,97.79 0 top
SYNC  13.34,48.26 180 top
TRIG_OUT  62.87,6.35 180 top
U1  9.84,62.23 270 bottom
U$1  [PIGATRON-LOGO]  19.43,4.06 0 top
VR1  58.42,73.66 180 top
VR2  34.92,78.74 180 top
VR3  11.43,72.39 180 top
VR4  53.34,97.79 180 top
WAVE  22.86,55.24 180 top

### Tracks (layer width: path | path; a pad name or v marks a point on that pad's centre or on a via)
3.3V
  Bottom 0.305: 31.81,98.74 C1.1 31.81,103.4 32.7,104.29 | 31.81,98.74 C2.1 | IC1.22 31.81,98.75 31.81,98.74 | C6.1 C5.1 40.95,104.24 42.22,105.51 44.35,105.51 46.67,103.19 46.67,97.16 | IC1.27 35.96,102 36.67,102.71 C6.1 | IC1.3 IC1.4 43.47,100.7 C3.1 C4.1 44.63,97.16 46.67,97.16 | C6.1 34.34,104.24 34.3,104.29 32.7,104.29 | 3.3V.1 8.89,83.82 27.3,83.82 33.66,90.17 44.13,90.17 46.67,92.71 46.67,97.16 | OLED_VCC.1 32.7,108.26 32.7,104.29
3.3VA  (via drill 0.35)
  Top 0.305: v3.81,71.12 3.81,76.2 3.3VA.1
  Bottom 0.305: v3.81,71.12 5.08,69.85 7.52,69.85 R5_B.2
+5V  (via drill 0.35)
  Top 0.305: v5.71,60.96 4.88,61.8 v4.88,74.93 4.88,78.09 1.69,81.28 5V.1
  Bottom 0.305: v5.71,60.96 8.79,60.96 U1.5 | R7_A.2 4.98,75.03 v4.88,74.93
-5V  (via drill 0.35)
  Top 0.305: S1.4 7.49,10.11 7.49,17.99 4.37,21.11 4.37,30.97 3.17,32.17 v3.17,69.22 -5V.1
  Bottom 0.305: R6_A.2 9.11,69.22 v3.17,69.22
N$1  (via drill 0.35)
  Top 0.305: v42.86,93.66 51.12,85.41 51.12,48.1 40.67,37.66 37.56,37.66 LED1.1
  Bottom 0.305: v42.86,93.66 42.86,94.46 41.82,95.5 IC1.12 | LED3.1 32.44,36.92 LED1.1 | 29.27,33.72 25.94,30.39 LED5.1 25.94,21.62 LED6.1 32.42,15.14 LED8.1 41.38,15.14 LED7.1 47.72,21.49 LED4.1 47.72,30.42 LED2.1
  Bottom 0.406: LED3.1 29.27,33.72
N$2  (via drill 0.35)
  Top 0.305: v63.82,29.84 65.24,31.27 65.24,65.24 PT3.1
  Bottom 0.305: R1_A.2 63.82,28.04 v63.82,29.84 | VR1.2 58.42,73.66 63.5,68.58 PT3.1
N$3  (via drill 0.35)
  Top 0.305: v41.27,91.92 50.1,83.09 50.1,48.52 42.22,40.64 33.89,40.64 32.67,39.42 32.67,34.47 34.53,32.61 LED1.4
  Bottom 0.305: IC1.17 35.79,95.5 36.09,95.2 36.09,95.13 39.3,91.92 v41.27,91.92 | LED1.4 34.23,32.61 LED3.4 30.26,28.63 LED5.4 30.26,23.41 LED6.4 34.2,19.46 LED8.4 39.59,19.46 LED7.4 43.4,23.28 LED4.4 43.4,28.63 LED2.4
N$4
  Bottom 0.305: OU1.P$1 21.04,38.81 CVO1.1
N$5
  Top 0.305: 6.1 3.17,104.78 3.17,90.81 7.13,86.85 7.13,76.14 8.89,74.38 8.89,42.55 11.36,40.07 11.36,36.97 10.79,36.4 10.79,7.62 12.06,6.35 S1.2
N$6  (via drill 0.35)
  Top 0.305: v42.07,92.87 50.61,84.33 50.61,48.31 42.31,40.01 33.98,40.01 33.18,39.21 33.18,35.08 34.26,34 LED1.3
  Bottom 0.305: IC1.13 41.67,94.85 42.07,94.46 v42.07,92.87 | LED1.3 33.65,34 LED3.3 28.86,29.21 LED5.3 28.86,22.83 LED6.3 33.63,18.07 LED8.3 40.17,18.07 LED7.3 44.8,22.7 LED4.3 44.8,29.21 LED2.3
N$7  (via drill 0.35)
  Top 0.305: v64.77,24.45 66.04,25.72 66.04,63.5 PT2.1
  Bottom 0.305: PT2.1 54.61,66.04 41.3,79.34 41.3,79.36 40.43,80.24 VR2.2 | R2_A.2 64.24,23.91 v64.77,24.45
N$8
  Bottom 0.305: OUT2.P$1 46.51,35.09 51.59,30 51.59,25.74 51.6,25.74 51.6,15.24 39.41,3.05 23.06,3.05 21.27,1.27 CVO2.1
N$9  (via drill 0.35)
  Top 0.305: v65.09,19.37 65.09,23.66 66.83,25.39 66.83,61.74 PT1.1
  Bottom 0.305: PT1.1 55.88,63.5 43.18,76.2 20.32,76.2 15.24,81.28 13.32,81.28 VR3.2 | R3_A.2 63.92,18.2 v65.09,19.37
N$10  (via drill 0.35)
  Top 0.305: v64.14,36.83 64.14,66.67 PT4.1
  Bottom 0.305: VR4.2 53.66,104.79 54.85,105.98 56.83,105.98 67.31,95.5 67.31,72.39 PT4.1 | R4_A.2 63.92,36.62 v64.14,36.83
N$11
  Bottom 0.305: R8_B.1 R7_A.1 8.26,78.72 VR3.3 12.85,83.31 27.52,83.31 29.94,85.74 VR2.3 34.31,87.63 48.95,87.63 | 48.95,87.63 VR1.3 | VR4.3 50.84,101.17 50.97,101.04 50.97,89.65 48.95,87.63
N$12
  Bottom 0.305: OUT3.P$1 51.04,24.61 51.04,15.39 39.2,3.56 21.98,3.56 20.19,1.78 5.21,1.78 3.17,3.81 CVO3.1
N$13
  Top 0.305: S1.5 4.37,10.24 4.37,19.54 3.17,20.74 2.12,20.74 OFFSET.1
N$14
  Bottom 0.305: CV6.1 60.96,48.26 56.02,48.26 53.34,48.26 49.53,52.07 49.53,62.23 44.77,66.99 6.67,66.99 2.46,62.79 2.46,45.23 1.67,44.43 AUX.P$1
N$15
  Bottom 0.305: R1_A.1 CV4_.1
N$16
  Bottom 0.305: OUT4.P$1 46.35,16.52 46.35,11.43 40.87,5.95 23.64,5.95 20.24,2.54 6.99,2.54 3.17,6.35 CVO4.1
N$17
  Bottom 0.305: R2_A.1 CV3_.1
N$18
  Bottom 0.305: R3_A.1 CV2_.1
N$19
  Bottom 0.305: R4_A.1 CV5_.1
N$20
  Bottom 0.305: CVO5.1 3.17,8.89 5.21,10.92 17.36,10.92 19.69,13.26 OUT5.P$1
N$21  (via drill 0.35)
  Top 0.305: VR3.1 15.82,81.28 34.29,81.28 37.42,84.42 VR2.1 | v53.13,82.34 59.24,82.34 VR1.1
  Bottom 0.305: VR3.1 14.92,78.4 R6_A.1 R5_B.1 | VR2.1 49.73,85.74 v53.13,82.34 | VR1.1 56.09,85.49 56.09,104.54 VR4.1
N$24
  Bottom 0.305: OUT6.P$1 22.62,16.91 17.14,11.43 CVO6.1
N$28
  Bottom 0.305: OUT7.P$1 12.03,14.01 3.21,14.01 3.17,13.97 CVO7.1
N$32
  Bottom 0.305: OUT8.P$1 9.2,16.51 CVO8.1
N$33  (via drill 0.35)
  Top 0.305: 7.1 3.68,106.81 3.68,91.76 10.99,84.45 26.35,84.45 v28.57,86.68
  Bottom 0.305: IC1.10 41.95,96.8 42.78,95.96 R18.2 43.65,95.85 43.65,93.18 41.27,90.81 32.7,90.81 v28.57,86.68
N$34
  Bottom 0.305: U1.4 9.84,59.91 R56.2
N$35  (via drill 0.35)
  Top 0.305: 5.1 2.67,102.74 2.67,90.59 6.63,86.64 6.63,75.92 8.38,74.17 8.38,67.44 v6.99,66.04
  Bottom 0.305: U1.2 9.84,64.45 8.26,66.04 v6.99,66.04
N$36
  Bottom 0.305: SW1.P2 15.7,104.79 14.5,105.98 6.92,105.98 5.08,104.14 5.08,100.33 ENCBTN.1
N$37
  Bottom 0.305: SW1.A 12.43,90.29 9.74,87.61 8.67,87.61 4.84,91.44 ENC2.1
N$38
  Bottom 0.305: SW1.B 17.82,91.48 12.9,91.48 9.53,88.11 8.88,88.11 3.02,93.98 ENC1.1
N$39
  Bottom 0.305: SYNC.P$1 14.61,44.53 29.77,44.53 33.34,40.96 43.66,40.96 52.7,31.91 52.7,21.59 59.05,15.24 CV1.1
N$41
  Bottom 0.305: WAVE.P$1 25.59,50.24 34.18,41.66 44.39,41.66 53.72,32.33 53.72,22.01 55.41,20.32 CV2.1
N$42
  Bottom 0.305: FREQ.P$1 36.2,53.42 64.22,25.4 CV3.1
N$43
  Bottom 0.305: CV4.1 64.77,30.48 46.99,48.26 PHASE.P$1
N$44
  Bottom 0.305: AMP.P$1 68.03,35.56 CV5.1
N$49
  Bottom 0.305: R56.1 9.84,44.13 14.61,39.37 22.86,39.37 23.72,40.23 43.67,40.23 52.2,31.7 52.2,18.83 62.87,8.16 TRIG_OUT.P$1
N$50  (via drill 0.35)
  Top 0.305: LED9.A LED16.A 24.34,87.12 33.33,96.11 v33.39,96.11 37.22,99.94 48.7,99.94 63.12,85.52 63.12,80.51 51.75,69.15 51.75,48.02 40.88,37.15 39.21,37.15 37.62,35.56 36.86,35.56 LED1.2
  Bottom 0.305: IC1.20 34.09,97.45 33.39,96.75 v33.39,96.11
N$51  (via drill 0.35)
  Top 0.305: v23.5,88.9 23.95,88.9 LED15.A 26.13,89.63 29.21,92.71 29.21,93.98 32.72,97.49 v33.02,97.49 35.98,100.45 48.91,100.45 63.63,85.73 63.63,80.3 52.26,68.94 52.26,47.81 41.91,37.46 41.91,34.26 LED2.2 | v13.34,86.68 12.32,86.68 LED13.A
  Bottom 0.305: v23.5,88.9 21.27,86.68 v13.34,86.68 | v33.02,97.49 33.63,98.1 IC1.21
N$52  (via drill 0.35)
  Top 0.305: v26.67,92.08 27.12,92.52 LED14.A 27.12,93.48 v33.34,99.69 34.6,100.96 49.12,100.96 64.14,85.94 64.14,80.09 52.93,68.89 52.93,46.67 55.88,43.71 55.88,40.41 43.41,27.94 31.11,27.94 28.57,30.48 28.57,31.08 LED3.2 | v9.21,88.9 8.48,89.63 LED12.A
  Bottom 0.305: v26.67,92.08 12.38,92.08 v9.21,88.9 | IC1.23 33.63,99.4 v33.34,99.69
N$62  (via drill 0.35)
  Top 0.305: LED16.C LED15.C LED14.C LED21.C v25.59,99.73 LED22.C LED23.C LED24.C LED17.C
  Bottom 0.305: IC1.16 30.46,94.85 v25.59,99.73
N$63  (via drill 0.35)
  Top 0.305: LED18.C LED19.C LED20.C LED10.C LED11.C LED12.C LED13.C v14.62,88.67 LED9.C
  Bottom 0.305: IC1.15 29.91,94.2 27,91.29 22.07,91.29 19.05,88.27 15.03,88.27 v14.62,88.67
N$65  (via drill 0.35)
  Top 0.305: v27.62,96.2 28.04,96.62 LED21.A 28.04,97.89 29.53,99.38 31.43,99.38 v32.75,100.69 33.54,101.49 49.31,101.49 64.64,86.15 64.64,79.88 53.49,68.73 53.49,46.82 56.52,43.8 56.52,40.32 46.32,30.13 LED4.2 | v5.4,94.61 5.4,93.62 LED11.A
  Bottom 0.305: v27.62,96.2 26.04,94.61 v5.4,94.61 | IC1.24 34.09,100.05 33.66,100.48 32.97,100.48 v32.75,100.69
N$66  (via drill 0.35)
  Top 0.305: v26.35,103.5 26.35,103.14 LED22.A 27.57,101.92 v32.7,101.92 32.86,102.08 49.44,102.08 65.15,86.36 65.15,79.67 54,68.52 54,47.03 57.02,44.01 57.02,40.11 51.66,34.75 51.66,25.4 50.7,24.45 28.26,24.45 27.3,25.4 27.3,26 LED5.2 | v5.08,99.06 5.08,97.89 LED10.A
  Bottom 0.305: v26.35,103.5 25.72,102.87 8.89,102.87 v5.08,99.06 | IC1.25 34.16,100.7 33.87,100.99 33.63,100.99 v32.7,101.92
N$67  (via drill 0.35)
  Top 0.305: v23.5,107 23.75,107 LED23.A 26.45,104.29 26.85,104.29 27.96,103.19 v32.7,103.19 33.09,103.19 33.56,102.72 49.51,102.72 65.66,86.57 65.66,79.46 61.04,74.85 61.04,29.13 62.3,27.87 62.3,25.47 58.42,21.59 43.5,21.59 42.23,22.86 36.2,22.86 31.75,18.41 31.12,18.41 LED6.2 | v6.35,103.5 5.71,102.86 LED20.A
  Bottom 0.305: v23.5,107 20,103.5 v6.35,103.5 | v32.7,103.19 33.63,102.26 33.63,102 34.27,101.35 IC1.26
N$68  (via drill 0.35)
  Top 0.305: v19.68,108.9 20.57,108.9 LED24.A 23.95,108.45 28.43,103.97 33.03,103.97 33.49,103.5 v33.97,103.5 49.45,103.5 66.17,86.78 66.17,79.25 61.55,74.64 61.55,29.34 62.81,28.08 62.81,25.26 58.63,21.08 45.34,21.08 LED7.2 | v9.21,107 8.27,106.06 LED19.A
  Bottom 0.305: v19.68,108.9 17.78,107 v9.21,107 | IC1.28 34.15,103.5 v33.97,103.5
N$69  (via drill 0.35)
  Top 0.305: LED18.A LED17.A 17.05,109.86 23.5,109.86 28.62,104.73 v42.55,104.73 48.94,104.73 66.67,87 66.67,79.04 64.8,77.17 64.8,73.04 62.06,70.3 62.06,29.55 63.32,28.29 63.32,25.05 58.84,20.57 51.32,20.57 46.46,15.72 39.53,15.72 38.7,16.54 LED8.2
  Bottom 0.305: IC1.1 42.55,104.32 v42.55,104.73
N$70
  Bottom 0.305: R17.2 43.29,102 IC1.2
PE  (via drill 0.35)
  Bottom 0.305: C6.2 v37.78,105.94 C5.2 | C2.2 v30.11,98.58 C1.2 | R17.1 C3.2 v45.46,99.16 C4.2 | IC1.8 38.27,98.1 IC1.29 | IC1.11 39.1,96.15 37.94,97.31 | IC1.18 36.78,96.15 37.94,97.31 | 37.94,97.31 IC1.29 | IC1.14 v39.47,94.2 37.94,95.73 IC1.29 | U1.1 8.89,62.87 9.21,62.55 10.48,62.55 10.79,62.86 U1.3 13.34,61.06 SYNC.P$3 | R18.1 45.46,94.67 v45.4,94.61 | R8_B.2 10.48,73.98 v10.16,73.66
  pour Top: 69.85,110.49 0,110.49 0,0 69.85,0
SCL  (via drill 0.35)
  Top 0.305: v42.44,98.16 38.47,98.16 33.97,93.66 | 33.97,93.66 v33.02,92.71 | v38.42,89.22 33.97,93.66
  Bottom 0.305: IC1.7 41.85,98.75 v42.44,98.16 | v33.02,92.71 25.7,85.39 9.46,85.39 8.48,86.36 19_SCL.1 | OLED_SCL.1 38.1,107.31 43.26,107.31 49.96,100.62 49.96,95.28 43.9,89.22 v38.42,89.22
SDA  (via drill 0.35)
  Top 0.305: v42.94,99.16 38.2,99.16 v31.75,92.71 31.75,92.39 v34.92,89.22
  Bottom 0.305: v31.75,92.71 24.93,85.89 9.67,85.89 6.66,88.9 18_SDA.1 | IC1.6 42.7,99.4 v42.94,99.16 | OLED_SDA.1 40.13,107.82 43.47,107.82 50.47,100.83 50.47,95.07 43.66,88.27 35.88,88.27 v34.92,89.22

### Text on the board
tNames: OCTOSOURCE | Rob Ellis 2021
bNames: 12V | GND | -12V
bValues: 74AHCT1G125